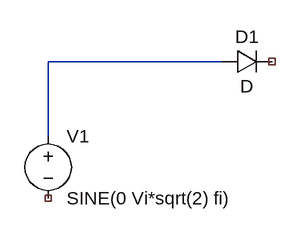
[diagram p0: schematic LTspice questao 1.lnk.asc]
LTspice questao 1.lnk.asc, the LTspice schematic file:
Version 4
SHEET 1 880 680
WIRE 240 32 16 32
WIRE 16 128 16 32
SYMBOL voltage 16 112 R0
WINDOW 123 0 0 Left 0
WINDOW 39 0 0 Left 0
SYMATTR InstName V1
SYMATTR Value SINE(0 Vi*sqrt(2) fi)
SYMBOL diode 240 48 R270
WINDOW 0 32 32 VTop 2
WINDOW 3 0 32 VBottom 2
SYMATTR InstName D1

The netlist it stands for:
* LTspice questao 1.lnk.asc
V1 N001 NC_01 SINE(0 Vi*sqrt(2) fi)
D1 N001 NC_02 D
.model D D
.lib standard.dio
.backanno
.end